# Altium schematic sheet CC2530.SchDoc
size A4
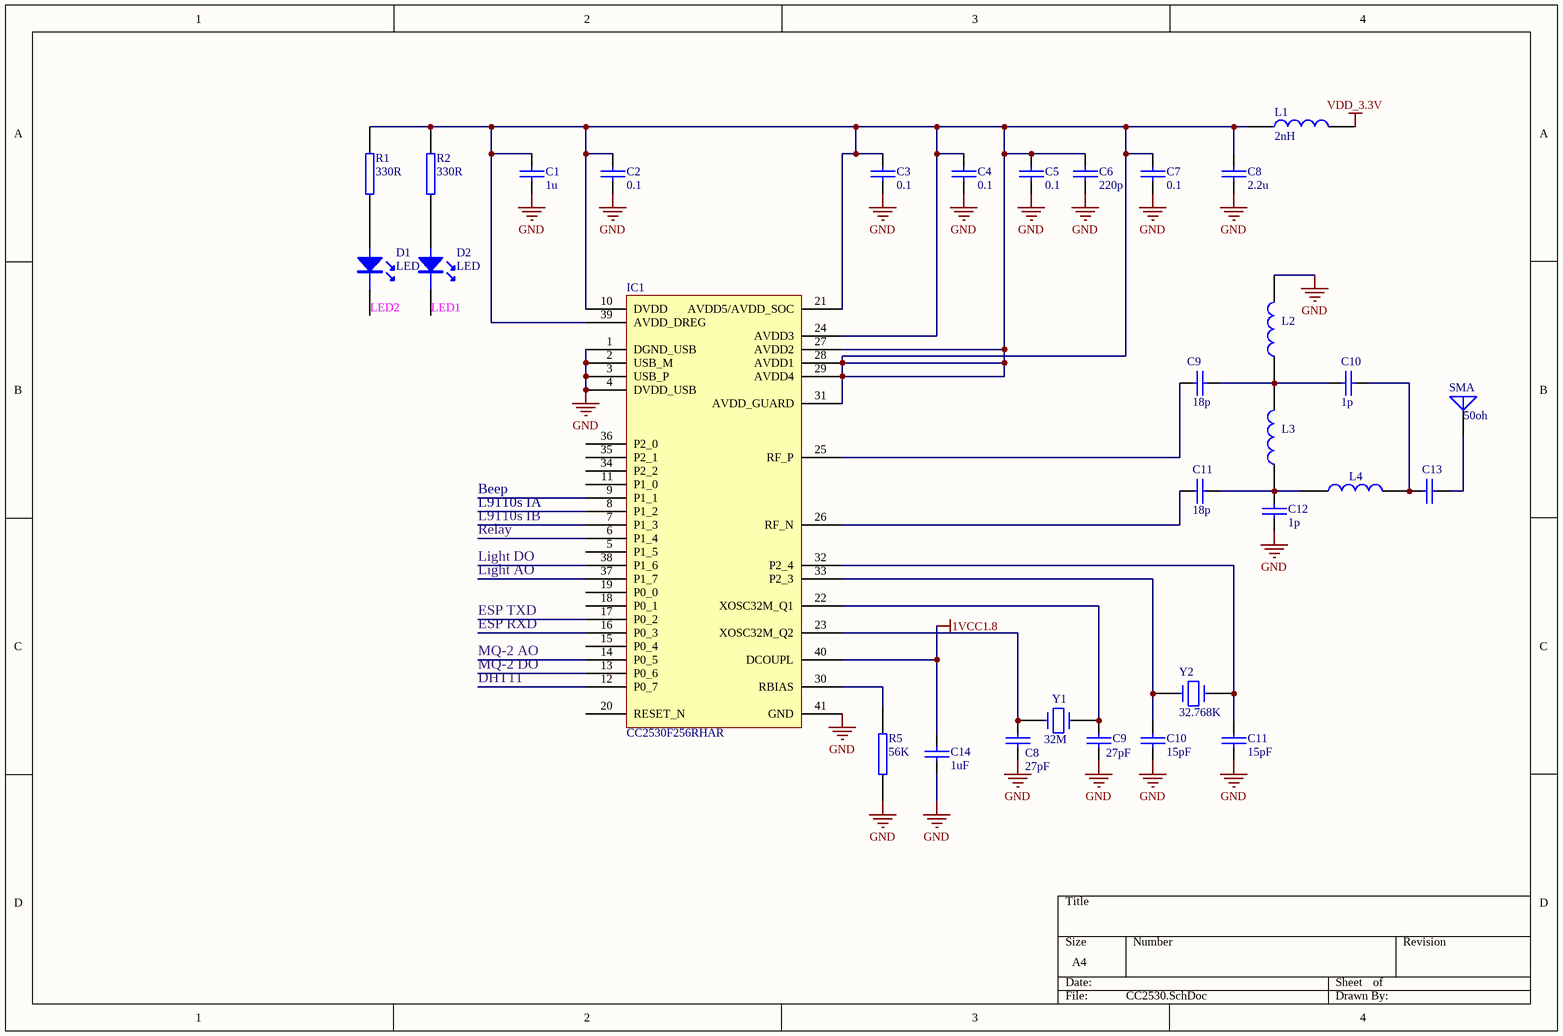
[diagram p0: CC2530.SchDoc]

## Parts
(Parts that share a designator on the sheet are numbered #1, #2 ... from top to bottom, then left to right.)
C1  1u  [0402]
C2  0.1  [0402]
C3  0.1  [0402]
C4  0.1  [0402]
C5  0.1  [0402]
C6  220p  [0402]
C7  0.1  [0402]
C8#1  2.2u  [0402]
C8#2  27pF  [0402]
C9#1  18p  [0402]
C9#2  27pF  [0402]
C10#1  1p  [0402]
C10#2  15pF  [0402]
C11#1  18p  [0402]
C11#2  15pF  [0402]
C12  1p  [0402]
C13  (no value)  [0402]
C14  1uF  [0402]
D1  LED  [LED-0603]
D2  LED  [LED-0603]
IC1  CC2530F256RHAR  [PVQFN-N40]
L1  2nH  [0402]
L2  (no value)  [0402]
L3  (no value)  [0402]
L4  (no value)  [0402]
R1  330R  [0402]
R2  330R  [0402]
R5  56K  [0402]
SMA  50oh  [ANT]
Y1  32M  [XT-SMD3225]
Y2  32.768K  [XT_3]

## Nets
1VCC1.8: C14.1 IC1.40(DCOUPL)
GND: C1.2 C2.2 C3.2 C4.2 C5.2 C6.2 C7.2 C8#1.2 C8#2.2 C9#2.2 C10#2.2 C11#2.2 C12.2 C14.2 IC1.1(DGND_USB) IC1.2(USB_M) IC1.3(USB_P) IC1.4(DVDD_USB) IC1.41(GND) L2.2 R5.2
VDD_3.3V: L1.2
DHT11: IC1.12(P0_7)
ESP RXD: IC1.16(P0_3)
ESP TXD: IC1.17(P0_2)
L9110s IB: IC1.7(P1_3)
LED1: D2.K
LED2: D1.K
Light AO: IC1.37(P1_7)
Light DO: IC1.38(P1_6)
MQ-2 AO: IC1.14(P0_5)
MQ-2 DO: IC1.13(P0_6)
Relay: IC1.6(P1_4)
NetC1_1: C1.1 C2.1 C3.1 C4.1 C5.1 C6.1 C7.1 C8#1.1 IC1.10(DVDD) IC1.21(AVDD5/AVDD_SOC) IC1.24(AVDD3) IC1.27(AVDD2) IC1.28(AVDD1) IC1.29(AVDD4) IC1.31(AVDD_GUARD) IC1.39(AVDD_DREG) L1.1 R1.2 R2.2
NetC8#2_1: C8#2.1 IC1.23(XOSC32M_Q2) Y1.1
NetC9#1_1: C9#1.1 IC1.25(RF_P)
NetC9#1_2: C9#1.2 C10#1.1 L2.1 L3.2
NetC9#2_1: C9#2.1 IC1.22(XOSC32M_Q1) Y1.2
NetC10#1_2: C10#1.2 C13.1 L4.2
NetC10#2_1: C10#2.1 IC1.33(P2_3) Y2.2
NetC11#1_1: C11#1.1 IC1.26(RF_N)
NetC11#1_2: C11#1.2 C12.1 L3.1 L4.1
NetC11#2_1: C11#2.1 IC1.32(P2_4) Y2.1
NetC13_2: C13.2 SMA.1(A)
NetD1_A: D1.A R1.1
NetD2_A: D2.A R2.1
NetIC1_30: IC1.30(RBIAS) R5.1

Not connected (* = marked no-connect by the designer): IC1 5(P1_5) 8(P1_2) 9(P1_1) 11(P1_0) 15(P0_4) 18(P0_1) 19(P0_0) 20(RESET_N) 34(P2_2) 35(P2_1) 36(P2_0)

## Notes on the sheet
- Beep
- L9110s IA

## Library data of the parts
C1-C7 C8#1 C8#2 C9#1 C9#2 C10#1 C10#2 C11#1 C11#2 C12-C14 = CAP: Capacitor
IC1 = CC2530
L1-L4 = INDUCTOR
R1 R2 R5 = RES2
SMA = ANTENNA: Generic Antenna
Y1 Y2 = CRYSTAL